# EAGLE design espsolr (EAGLE 9.1.0)
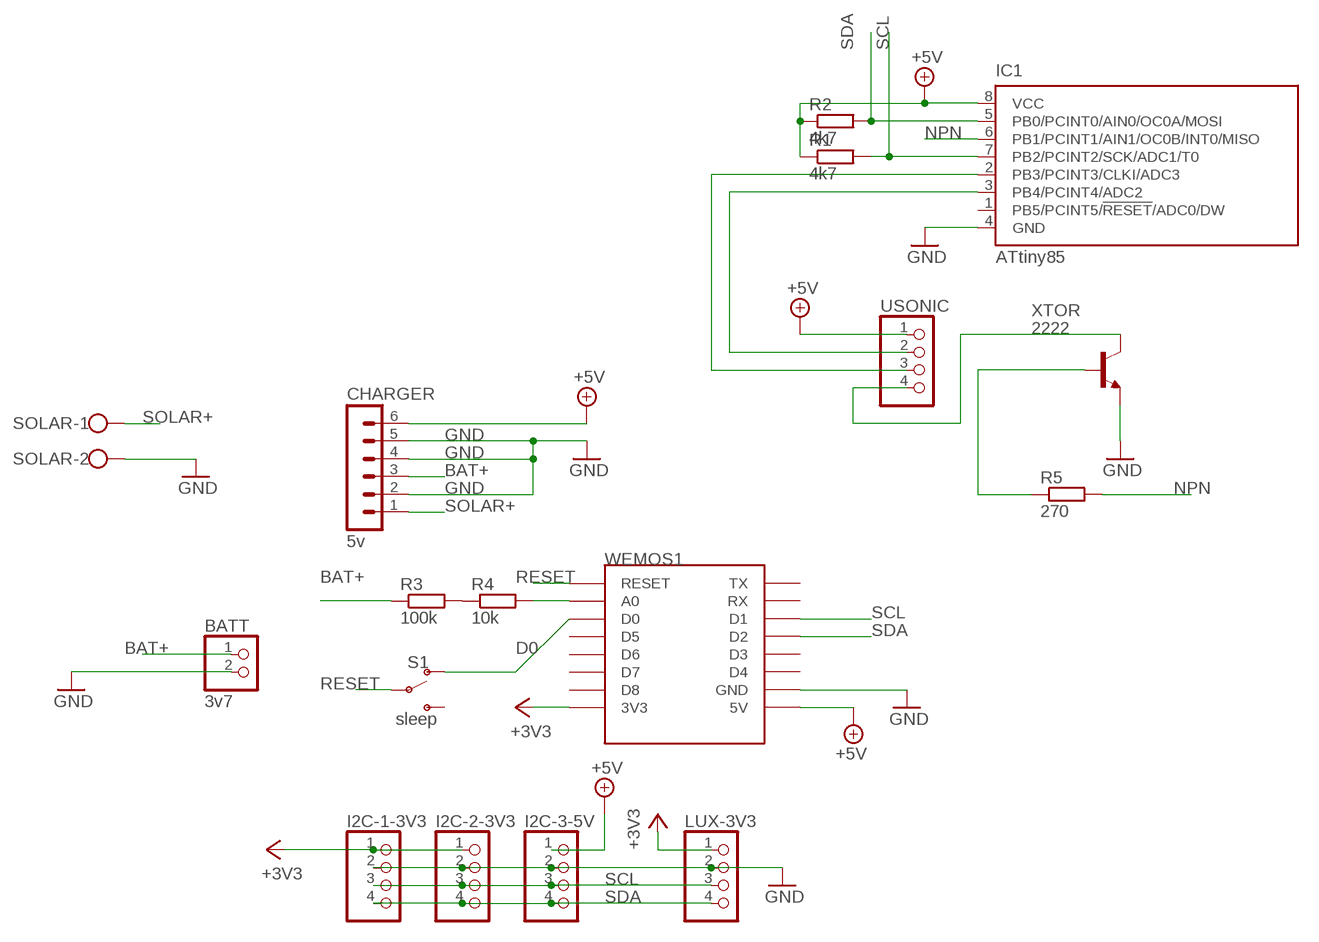
[diagram p0: schematic, sheet 1]

## Parts
BATT  3v7  PINHD-1X2  [1X02]
CHARGER  5v  MA06-1  [MA06-1]
I2C-1-3V3  PINHD-1X4  [1X04]
I2C-2-3V3  PINHD-1X4  [1X04]
I2C-3-5V  PINHD-1X4  [1X04]
IC1  ATtiny85  TINY13-20PU  [DIL08]
LUX-3V3  PINHD-1X4  [1X04]
R1  4k7  R-EU_0204/7  [0204/7]
R2  4k7  R-EU_0204/7  [0204/7]
R3  100k  R-EU_0204/7  [0204/7]
R4  10k  R-EU_0204/7  [0204/7]
R5  270  R-EU_0204/7  [0204/7]
S1  sleep  SWITCH-SPDT-PTH-11.6X4.0MM  [SWITCH_SPDT_PTH_11.6X4.0MM]
SOLAR  W237-102  [W237-102]
USONIC  PINHD-1X4  [1X04]
WEMOS1  WEMOS-D1-MINI  [WEMOS-D1-MINI]
XTOR  2222  2N2222-NPN-TO92-EBC  [TO92-EBC]

## Nets
+3V3: I2C-1-3V3.1 I2C-2-3V3.1 LUX-3V3.1 WEMOS1.3V3
+5V [1amp]: CHARGER.6 I2C-3-5V.1 IC1.8(VCC) R1.1 R2.1 USONIC.1 WEMOS1.5V
BAT+: BATT.1 CHARGER.3 R3.1
D0: S1.1(O) WEMOS1.D0
GND [1amp]: BATT.2 CHARGER.2 CHARGER.4 CHARGER.5 I2C-1-3V3.2 I2C-2-3V3.2 I2C-3-5V.2 IC1.4(GND) LUX-3V3.2 SOLAR.2 WEMOS1.GND XTOR.E
N$1: R3.2 R4.1
N$2: R4.2 WEMOS1.A0
N$7: IC1.2(PB3/PCINT3/CLKI/ADC3) USONIC.3
N$8: IC1.3(PB4/PCINT4/ADC2) USONIC.2
N$9: USONIC.4 XTOR.C
N$10: R5.1 XTOR.B
NPN: IC1.6(PB1/PCINT1/AIN1/OC0B/INT0/MISO) R5.2
RESET: S1.2(P) WEMOS1.RESET
SCL: I2C-1-3V3.3 I2C-2-3V3.3 I2C-3-5V.3 IC1.7(PB2/PCINT2/SCK/ADC1/T0) LUX-3V3.3 R1.2 WEMOS1.D1
SDA: I2C-1-3V3.4 I2C-2-3V3.4 I2C-3-5V.4 IC1.5(PB0/PCINT0/AIN0/OC0A/MOSI) LUX-3V3.4 R2.2 WEMOS1.D2
SOLAR+: CHARGER.1 SOLAR.1
Unconnected: IC1.1(PB5/PCINT5/!RESET!/ADC0/DW) S1.3(S) WEMOS1.D3 WEMOS1.D4 WEMOS1.D5 WEMOS1.D6 WEMOS1.D7 WEMOS1.D8 WEMOS1.RX WEMOS1.TX

## Library data of the parts
BATT = pinhead:PINHD-1X2: PIN HEADER
CHARGER = con-lstb:MA06-1: PIN HEADER; OC_FARNELL: unknown; OC_NEWARK: unknown
I2C-1-3V3 I2C-2-3V3 I2C-3-5V LUX-3V3 USONIC = pinhead:PINHD-1X4: PIN HEADER
IC1 = atmel:TINY13: 8-bit AVR Microcontroller with 1K Bytes In-System Programmable Flash Source: http://www.atmel.com/dyn/resources/prod_documents/2535S.pdf; MPN: ATTINY13-20PU; OC_FARNELL: 9171550; OC_NEWARK: 96K6521
R1-R5 = resistor:R-EU_: RESISTOR, European symbol
S1 = SparkFun-Switches:SWITCH-SPDT: Single Pole, Double Throw (SPDT) Switch Single-pole, double-throw (SPDT) switch. Variant Overview SMD-AYZ0202 Surface Mount DPDT Switch <https://www.sparkfun.com/products/597> (COM-00597) Used on e.g. LilyPad Arduino USB - ATmega32U4 Board <https://www.sparkfun.com/products/12049> PTH-11.6X4.0MM SPDT Mini Power Switch <https://www.sparkfun.com/products/102> (COM-00102) Used on e.g. SparkFun Simon Says - Through-Hole Soldering Kit <https://www.sparkfun.com/products/10547> (KIT-10547) PTH-11.6X4.0MM-KIT KIT version of SPDT Mini Power Switch - Simplifies soldering by removing tStop of switch pins - only one side can be soldered. PTH-11.6X4.0MM-LOCK LOCK version of SPDT Mini Power Switch - Offset pins hold switch in place for easier soldering. SMD-RIGHT-ANGLE Surface Mount Right Angle Switch <https://www.sparkfun.com/products/10860> (COM-10860) Used on e.g. SparkFun ESP8266 Thing <https://www.sparkfun.com/products/13231>; PROD_ID: SWCH-08261; SF_SKU: COM-00102
SOLAR = con-wago-500:W237-102: WAGO SCREW CLAMP; MPN: 237-102; OC_FARNELL: unknown; OC_NEWARK: 70K9898
WEMOS1 = esp8266modules:WEMOS-D1-MINI: WeMos.cc D1 mini ESP8266 module
XTOR = transistor-neu-to92:*-NPN-: NPN Transistror

## Net classes
1 1amp: width 0.508 mm

## Board
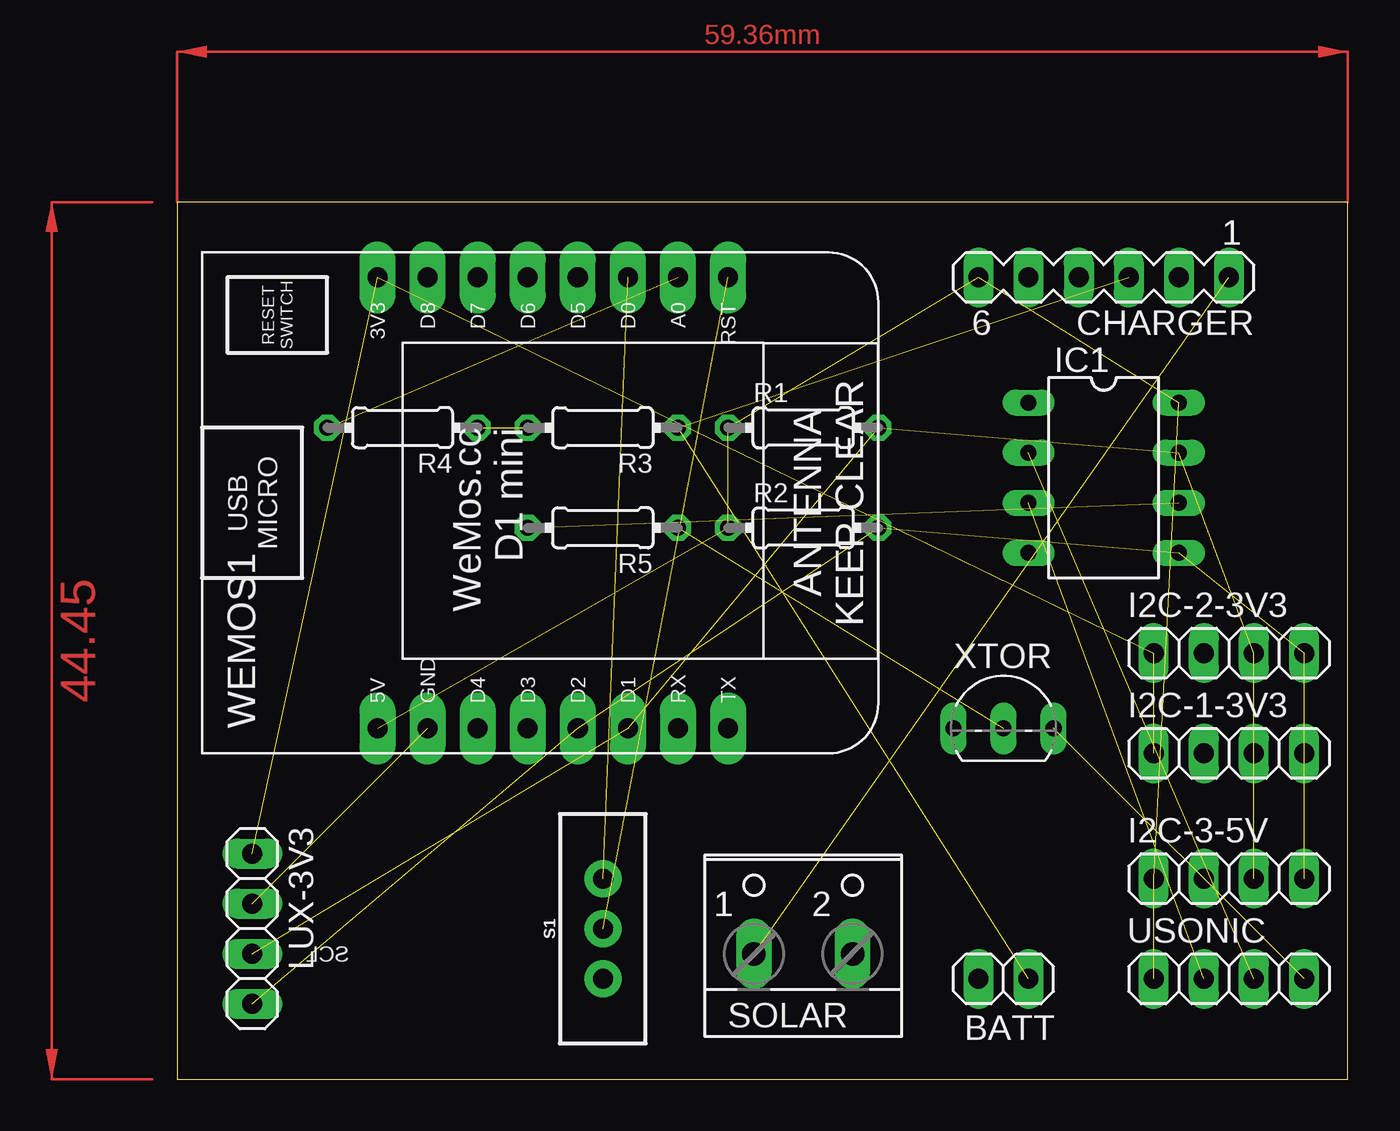
[diagram p1: board, top side]
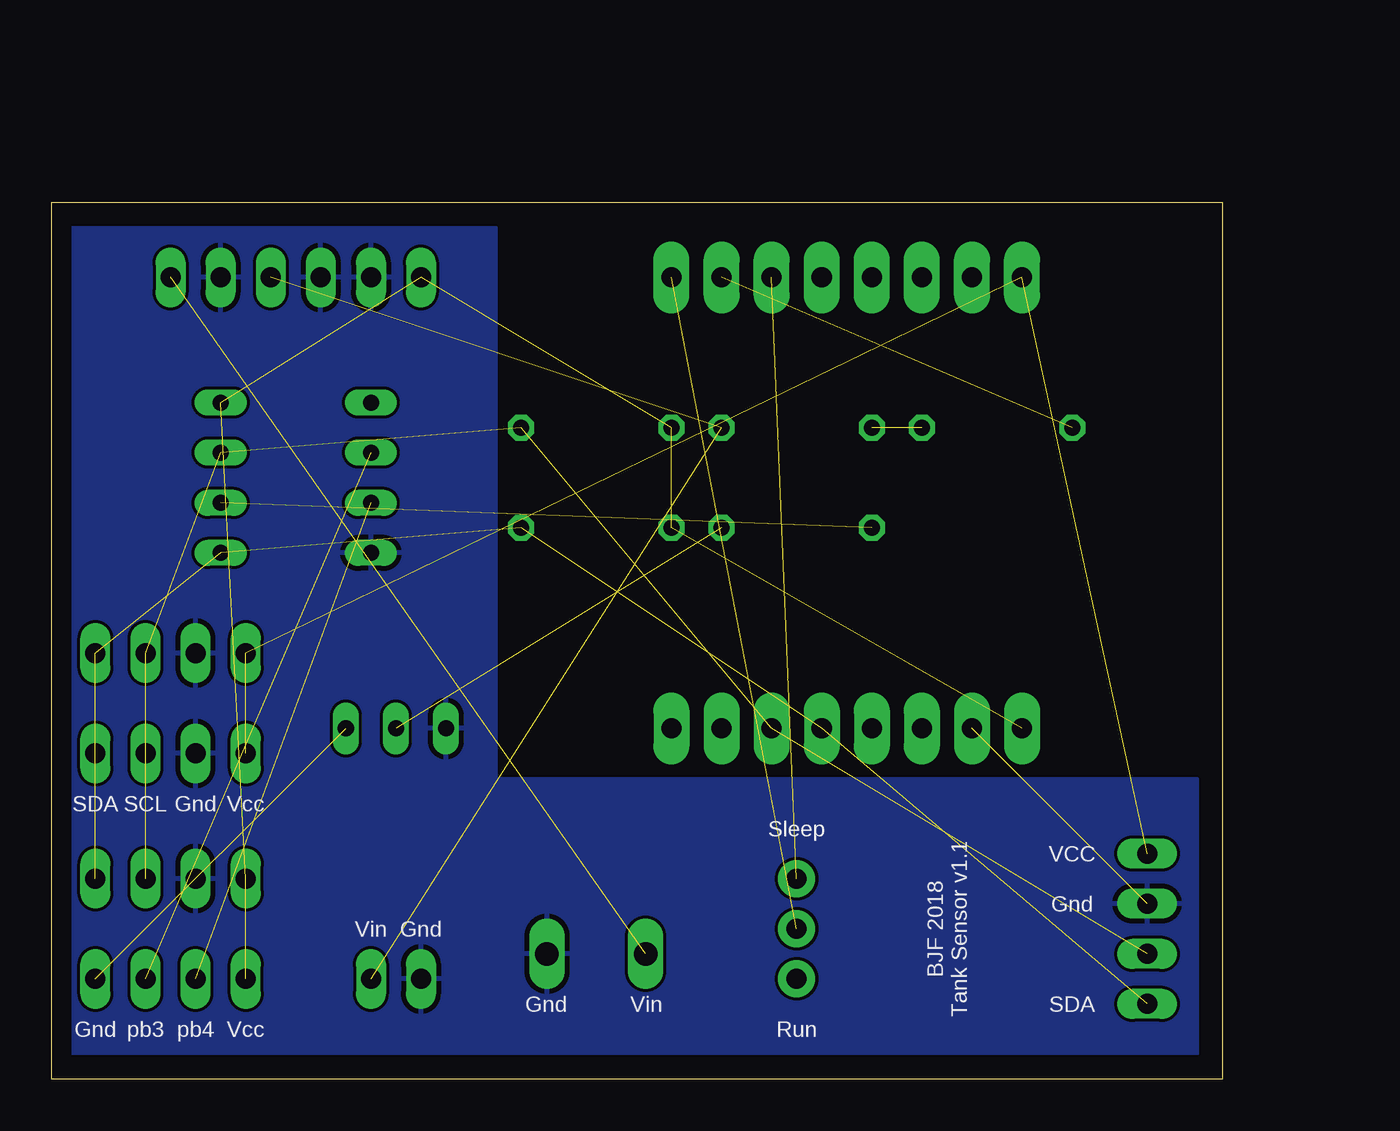
[diagram p2: board, bottom side, seen from below]

Size 59.36 x 44.44 mm. Coordinates in mm from the lower left corner, seen from the top.
Outline: 0,0 59.36,0 59.36,44.44 0,44.44 0,0
Copper layers (1*16): Top 0.035mm / dielectric 1.5mm / Bottom 0.035mm
Design rules "default": minimum track width 6mil, minimum drill 0.35mm, track to track 6mil, track to pad 6mil, pad to pad 6mil, via to via 6mil, smd to smd 6mil, copper to edge 40mil, drill to drill 6mil, minimum pad ring 10mil, minimum via ring 8mil, stop-mask expansion 4mil, vias tented up to drill 0mil, thermal gap 10mil

### Footprints (pad centres in the part's own frame; a part is rotated, then mirrored left to right if it is on the bottom)
1X02 = drill 1.016 long: 1 -1.27,0; 2 1.27,0
MA06-1 = drill 1.016 long: 1 -6.35,0; 2 -3.81,0; 3 -1.27,0; 4 1.27,0; 5 3.81,0; 6 6.35,0
1X04 = drill 1.016 long: 1 -3.81,0; 2 -1.27,0; 3 1.27,0; 4 3.81,0
DIL08 = drill 0.813 long: 1 -3.81,-3.81; 2 -1.27,-3.81; 3 1.27,-3.81; 4 3.81,-3.81; 5 3.81,3.81; 6 1.27,3.81; 7 -1.27,3.81; 8 -3.81,3.81
0204/7 = drill 0.813 octagon: 1 -3.81,0; 2 3.81,0
SWITCH_SPDT_PTH_11.6X4.0MM = drill 1.016 pad 1.88: 1 0,2.54; 2 0,0; 3 0,-2.54
W237-102 = drill 1.194 long: 1 -2.5,-1.27; 2 2.5,-1.27
WEMOS-D1-MINI = drill 1.016 pad 1.829 long: 3V3 -10.16,-10.16; 5V 12.7,-10.16; A0 -10.16,5.08; D0 -10.16,2.54; D1 12.7,2.54; D2 12.7,0; D3 12.7,-2.54; D4 12.7,-5.08; D5 -10.16,0; D6 -10.16,-2.54; D7 -10.16,-5.08; D8 -10.16,-7.62; GND 12.7,-7.62; RESET -10.16,7.62; RX 12.7,5.08; TX 12.7,7.62
TO92-EBC = drill 0.813 long: B 0,-1.27; C 2.54,-1.27; E -2.54,-1.27

### Placement (x,y rotation side)
BATT  41.91,5.08 180 top
CHARGER  46.99,40.64 180 top
I2C-1-3V3  53.34,16.51 0 top
I2C-2-3V3  53.34,21.59 0 top
I2C-3-5V  53.34,10.16 0 top
IC1  46.99,30.48 270 top
LUX-3V3  3.81,7.62 270 top
R1  31.75,33.02 0 top
R2  31.75,27.94 0 top
R3  21.59,33.02 180 top
R4  11.43,33.02 180 top
R5  21.59,27.94 180 top
S1  21.59,7.62 0 top
SOLAR  31.75,7.62 0 top
USONIC  53.34,5.08 0 top
WEMOS1  20.32,30.48 270 top
XTOR  41.91,19.05 0 top

### Tracks (layer width: path | path; a pad name or v marks a point on that pad's centre or on a via)
+3V3  (3 unrouted)
+5V  (6 unrouted)
BAT+  (2 unrouted)
D0  (1 unrouted)
GND  (1 unrouted)
  pour Bottom: 1.27,1.27 59.69,1.27 59.69,43.18 36.83,43.18 36.83,15.24 1.27,15.24 1.27,5.08
N$1  (1 unrouted)
N$2  (1 unrouted)
N$7  (1 unrouted)
N$8  (1 unrouted)
N$9  (1 unrouted)
N$10  (1 unrouted)
NPN  (1 unrouted)
RESET  (1 unrouted)
SCL  (6 unrouted)
SDA  (6 unrouted)
SOLAR+  (1 unrouted)
(copper drawn outside any net)
  shapes: Top area x2

### Text on the board
tNames: SCL
bNames: Vcc | Gnd | SCL | SDA | Sleep | VCC | Gnd | BJF 2018 / Tank Sensor v1.1 | Gnd | Vin | SDA | Vin | Gnd | Run | Vcc | pb4 | pb3 | Gnd